# Altium project buoy_v2.0_AA.PrjPcb
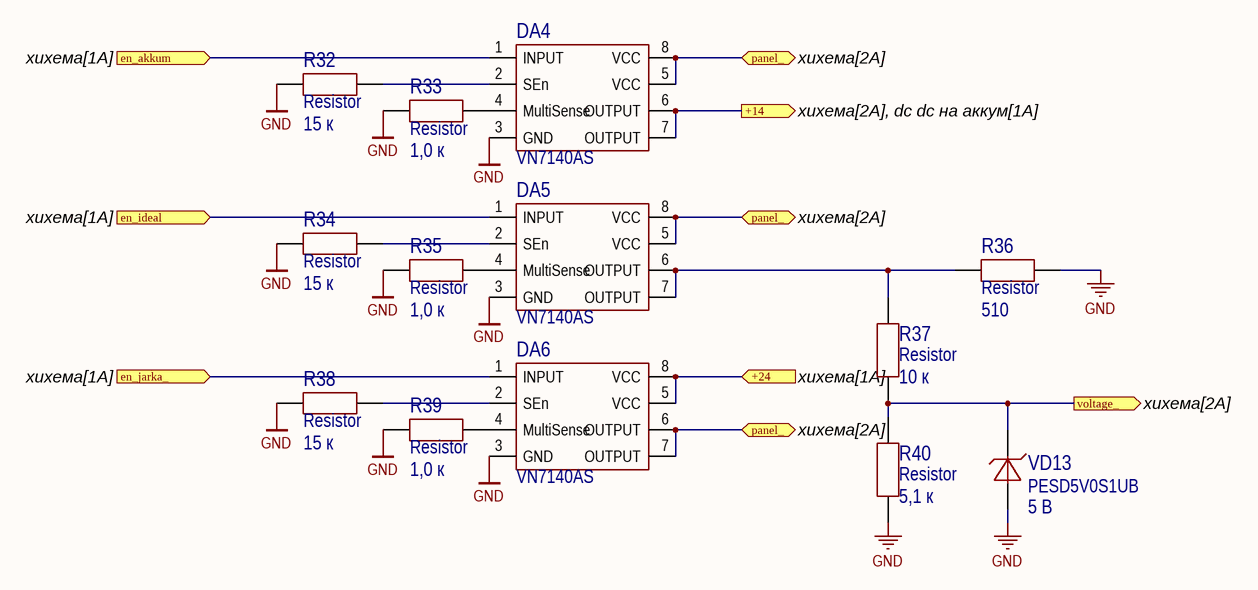
[diagram p0: switches.SchDoc]
3 sheets, 36 parts. Net scope: flat (ports and power ports of the same name join across sheets).
Board file: õ__ëîãèÿ_v25.PcbDoc
Sheets:
  switches.SchDoc
  dc dc sepic 12-12.SchDoc
  dc dc 5v.SchDoc

## Sheet switches.SchDoc
size A4; SheetNumber: 3; SheetTotal: 6

### Parts
DA4  VN7140AS  [SOP8]
DA5  VN7140AS  [SOP8]
DA6  VN7140AS  [SOP8]
R32  Resistor  value 15 к  [0603R]
R33  Resistor  value 1,0 к  [0603R]
R34  Resistor  value 15 к  [0603R]
R35  Resistor  value 1,0 к  [0603R]
R36  Resistor  value 510  [2512R]
R37  Resistor  value 10 к  [0603R]
R38  Resistor  value 15 к  [0603R]
R39  Resistor  value 1,0 к  [0603R]
R40  Resistor  value 5,1 к  [0603R]
VD13  PESD5V0S1UB  value 5 В  [SOD523]

### Ports
+14 (out, see хихема[2A], dc dc на аккум[1A]), +24 (in, see хихема[1A]), en_akkum (in, see хихема[1A]), en_ideal (in, see хихема[1A]), en_jarka_ (in, see хихема[1A]), panel_ (bidir, see хихема[2A]), voltage_ (out, see хихема[2A])

### Nets
GND: DA4.3(GND) DA5.3(GND) DA6.3(GND) R32.1 R33.1 R34.1 R35.1 R36.2 R38.1 R39.1 R40.1 VD13.1
NetDA4_1: DA4.1(INPUT) ; port en_akkum
NetDA4_2: DA4.2(SEn) R32.2
NetDA4_4: DA4.4(MultiSense) R33.2
NetDA4_5: DA4.5(VCC) DA4.8(VCC) DA5.5(VCC) DA5.8(VCC) DA6.6(OUTPUT) DA6.7(OUTPUT) ; port panel_
NetDA4_6: DA4.6(OUTPUT) DA4.7(OUTPUT) ; port +14
NetDA5_1: DA5.1(INPUT) ; port en_ideal
NetDA5_2: DA5.2(SEn) R34.2
NetDA5_4: DA5.4(MultiSense) R35.2
NetDA5_6: DA5.6(OUTPUT) DA5.7(OUTPUT) R36.1 R37.2
NetDA6_1: DA6.1(INPUT) ; port en_jarka_
NetDA6_2: DA6.2(SEn) R38.2
NetDA6_4: DA6.4(MultiSense) R39.2
NetDA6_5: DA6.5(VCC) DA6.8(VCC) ; port +24
NetR37_1: R37.1 R40.2 VD13.2 ; port voltage_

### Library data of the parts
DA4-DA6 = VN7140AS: Силовой ключ верхнего плеча с аналоговой обратной связью MultiSense автомобильного применения; Part Number: VN7140AS
R32 R34 R38 = Resistor_15k_1_0603: Резистор номиналом 15 кОм и точностью 1%; Power: *; Part Number: Resistor_15k_1_0603; Tolerance: 1%
R33 R35 R39 = Resistor_1.0k_1_0603: Резистор номиналом 1,0 кОм и точностью 1%; Power: *; Part Number: Resistor_1.0k_1_0603; Tolerance: 1%
R36 = Resistor_510_1_0603: Резистор номиналом 510 Ом и точностью 1%; Power: *; Part Number: Resistor_510_1_0603; Tolerance: 1%
R37 = Resistor_10k_1_0603: Резистор номиналом 10 кОм и точностью 1%; Power: *; Part Number: Resistor_10k_1_0603; Tolerance: 1%
R40 = Resistor_5.1k_1_0603: Резистор номиналом 5,1 кОм и точностью 1%; Power: *; Part Number: Resistor_5.1k_1_0603; Tolerance: 1%
VD13 = PESD5V0S1UB: Защитный диод на 5 В, рассеиваемая мощность 330 Вт; Voltage nominal (V): 5; Power (W): 330; Part Number: PESD5V0S1UB

## Sheet dc dc sepic 12-12.SchDoc
size A3; SheetNumber: 5; SheetTotal: 6
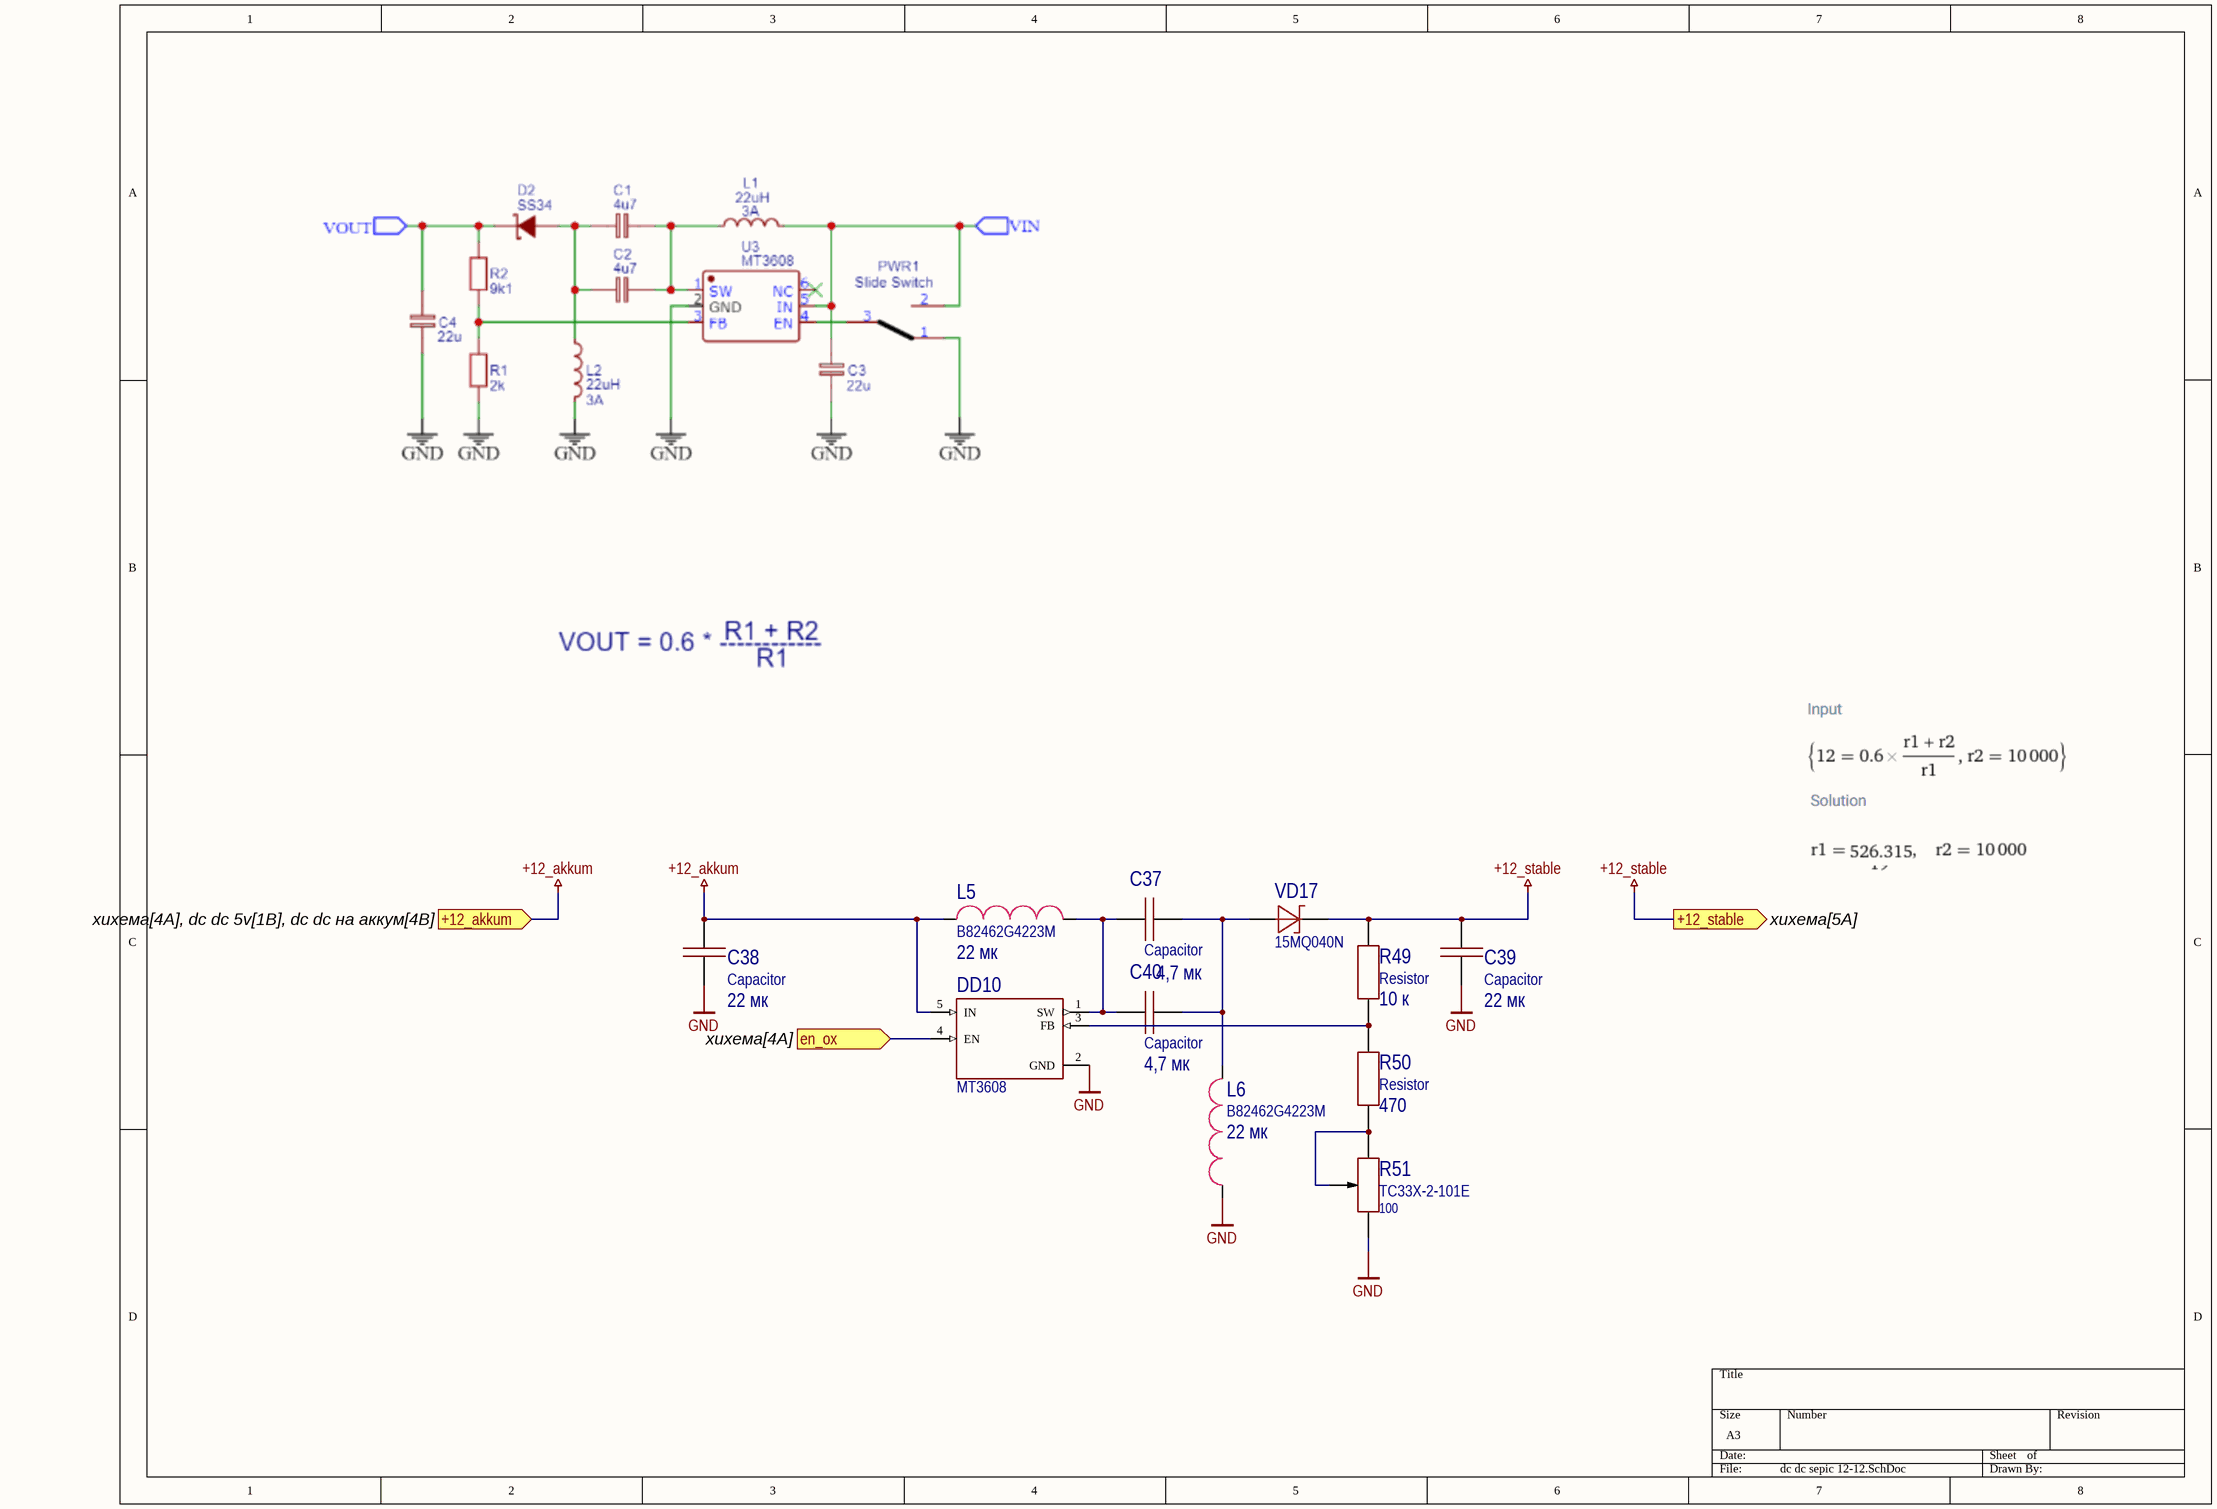
[diagram p1: dc dc sepic 12-12.SchDoc]

### Parts
C37  Capacitor  value 4,7 мк  [1206C]
C38  Capacitor  value 22 мк  [1210C]
C39  Capacitor  value 22 мк  [1210C]
C40  Capacitor  value 4,7 мк  [1206C]
DD10  MT3608  [SOT23-6]
L5  B82462G4223M  value 22 мк  [B82462G4]
L6  B82462G4223M  value 22 мк  [B82462G4]
R49  Resistor  value 10 к  [0603R]
R50  Resistor  value 470  [0603R]
R51  TC33X-2-101E  value 100  [3mm_trim]
VD17  15MQ040N  [SMA]

### Ports
+12_akkum (in, see хихема[4A], dc dc 5v[1B], dc dc на аккум[4B]), +12_stable (out, see хихема[5A]), en_ox (in, see хихема[4A])

### Nets
+12_akkum: C38.2 DD10.5(IN) L5.1 ; port +12_akkum
+12_stable: C39.2 R49.2 VD17.2 ; port +12_stable
GND: C38.1 C39.1 DD10.2(GND) L6.1 R51.1
NetC37_1: C37.1 C40.1 DD10.1(SW) L5.2
NetC37_2: C37.2 C40.2 L6.2 VD17.1
NetDD10_3: DD10.3(FB) R49.1 R50.2
NetDD10_4: DD10.4(EN) ; port en_ox
NetR50_1: R50.1 R51.2 R51.3

### Library data of the parts
C37 C40 = Capacitor_4,7u_10_50V_X7R_1206C: Конденсатор; Tolerance: 0,1; Voltage (V): 50; Dielectric: X7R; Capacity (nF): 4700; Part Number: Capacitor_4,7u_10_50V_X7R_1206C
C38 C39 = Capacitor_22u_10_25V_X7R_1210C: Конденсатор; Tolerance: 0,1; Voltage (V): 25; Dielectric: X7R; Capacity (nF): 22000; Part Number: Capacitor_22u_10_25V_X7R_1210C
DD10 = MT3608: Повышающий/SEPIC DC-DC преобразователь 2А 1.2МГц; Part Number: MT3608
L5 L6 = B82462G4223M: ЧИП-индуктивность 22мкГн, 1.05A, ±20% катушка; Inductance (μH): 22; Current (A): 1.05; Part Number: B82462G4223M
R49 = Resistor_10k_1_0603: Резистор номиналом 10 кОм и точностью 1%; Power: *; Part Number: Resistor_10k_1_0603; Tolerance: 1%
R50 = Resistor_470_1_0603: Резистор номиналом 470 Ом и точностью 1%; Power: *; Part Number: Resistor_470_1_0603; Tolerance: 1%
R51 = TC33X-2-101E: Потенциометр керметный 100 Ом 0.1Вт для поверхностного монтажа; Tolerance: 50%; Part Number: TC33X-2-101E
VD17 = 15MQ040N: Диод шоттки на 40 В, ном. ток 2.1 А; Voltage nominal (V): 40; Current (A): 2.1; Part Number: 15MQ040N

## Sheet dc dc 5v.SchDoc
size A4; SheetNumber: 6; SheetTotal: 6
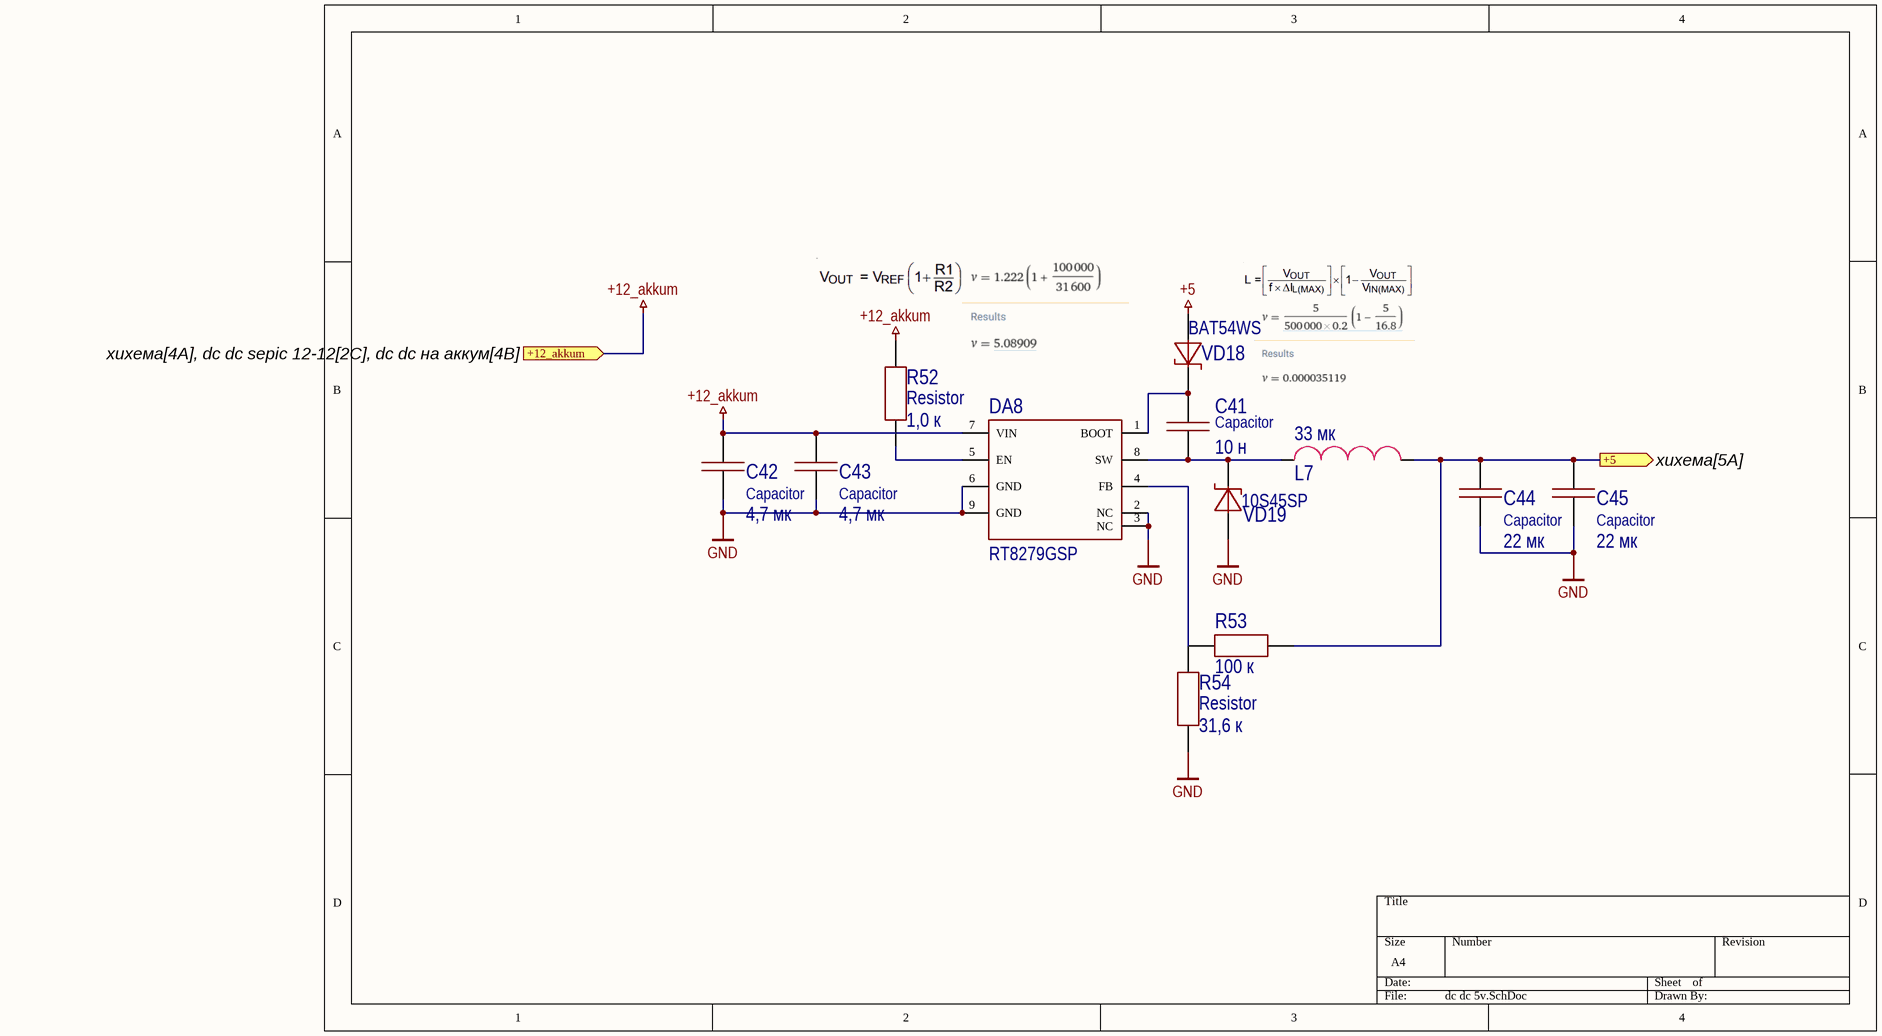
[diagram p2: dc dc 5v.SchDoc]

### Parts
C41  Capacitor  value 10 н  [0603C]
C42  Capacitor  value 4,7 мк  [1206C]
C43  Capacitor  value 4,7 мк  [1206C]
C44  Capacitor  value 22 мк  [1210C]
C45  Capacitor  value 22 мк  [1210C]
DA8  RT8279GSP  [8SOP(Exposed_Pad)]
L7  value 33 мк  [IHLP-4040]  (hidden comment: IHLP4040DZER330M11)
R52  Resistor  value 1,0 к  [0603R]
R53  value 100 к  [0603R]  (hidden comment: Resistor)
R54  Resistor  value 31,6 к  [0603R]
VD18  BAT54WS  [SOD-323]
VD19  10S45SP  [TO-277]

### Ports
+5 (out, see хихема[5A]), +12_akkum (in, see хихема[4A], dc dc sepic 12-12[2C], dc dc на аккум[4B])

### Nets
+5: VD18.1
+12_akkum: C42.2 C43.2 DA8.7(VIN) R52.2 ; port +12_akkum
GND: C42.1 C43.1 C44.1 C45.1 DA8.2(NC) DA8.3(NC) DA8.6(GND) DA8.9(GND) R54.1 VD19.1
NetC41_1: C41.1 DA8.8(SW) L7.1 VD19.2
NetC41_2: C41.2 DA8.1(BOOT) VD18.2
NetC44_2: C44.2 C45.2 L7.2 R53.2 ; port +5
NetDA8_4: DA8.4(FB) R53.1 R54.2
NetDA8_5: DA8.5(EN) R52.1

### Library data of the parts
C41 = Capacitor_10n_10_50V_X7R_0603C: Конденсатор; Tolerance: 0,1; Voltage (V): 50; Dielectric: X7R; Capacity (nF): 10; Part Number: Capacitor_10n_10_50V_X7R_0603C
C42 C43 = Capacitor_4,7u_10_50V_X7R_1206C: as C37 on sheet dc dc sepic 12-12; Part Number: Capacitor_4,7u_10_50V_X7R_1206C
C44 C45 = Capacitor_22u_10_25V_X7R_1210C: as C38 on sheet dc dc sepic 12-12; Part Number: Capacitor_22u_10_25V_X7R_1210C
DA8 = RT8279GSP: Преобразователь постоянного тока понижающий подстраиваемый выход 5А; Part Number: RT8279GSP
L7 = IHLP4040DZER330M11: ЧИП-индуктивность экранированная 33мкГн ±20% 4,4A 94,5мОм 4040; Inductance (μH): 33; Current (A): 4,4; Part Number: IHLP4040DZER330M11
R52 = Resistor_1.0k_1_0603: as R33 on sheet switches; Power: *; Part Number: Resistor_1.0k_1_0603; Tolerance: 1%
R53 = Resistor_100k_1_0603: Резистор номиналом 100 кОм и точностью 1%; Power: *; Part Number: Resistor_100k_1_0603; Tolerance: 1%
R54 = Resistor_31.6k_1_0603: Резистор номиналом 31,6 кОм и точностью 1%; Power: *; Part Number: Resistor_31.6k_1_0603; Tolerance: 1%
VD18 = BAT54WS: Диод шоттки на 30 В, ном. ток 0.2 А; Voltage nominal (V): 30; Current (A): 0.2; Part Number: BAT54WS
VD19 = 10S45SP: Диод шоттки на 45 В, ном. ток 10 А; Voltage nominal (V): 45; Current (A): 10; Part Number: 10S45SP

## Nets that join several sheets
+12_akkum: dc dc sepic 12-12 (C38.2 DD10.5 L5.1), dc dc 5v (C42.2 C43.2 DA8.7 R52.2)
GND: switches (12 pins), dc dc sepic 12-12 (5 pins), dc dc 5v (10 pins)

## Assembly variants
default: not fitted C9 D1 DD4 R7 R8 R19 SB1 SB2 SB3 SB4 SB5